# Altium project IndependentSTM32.PrjPcb
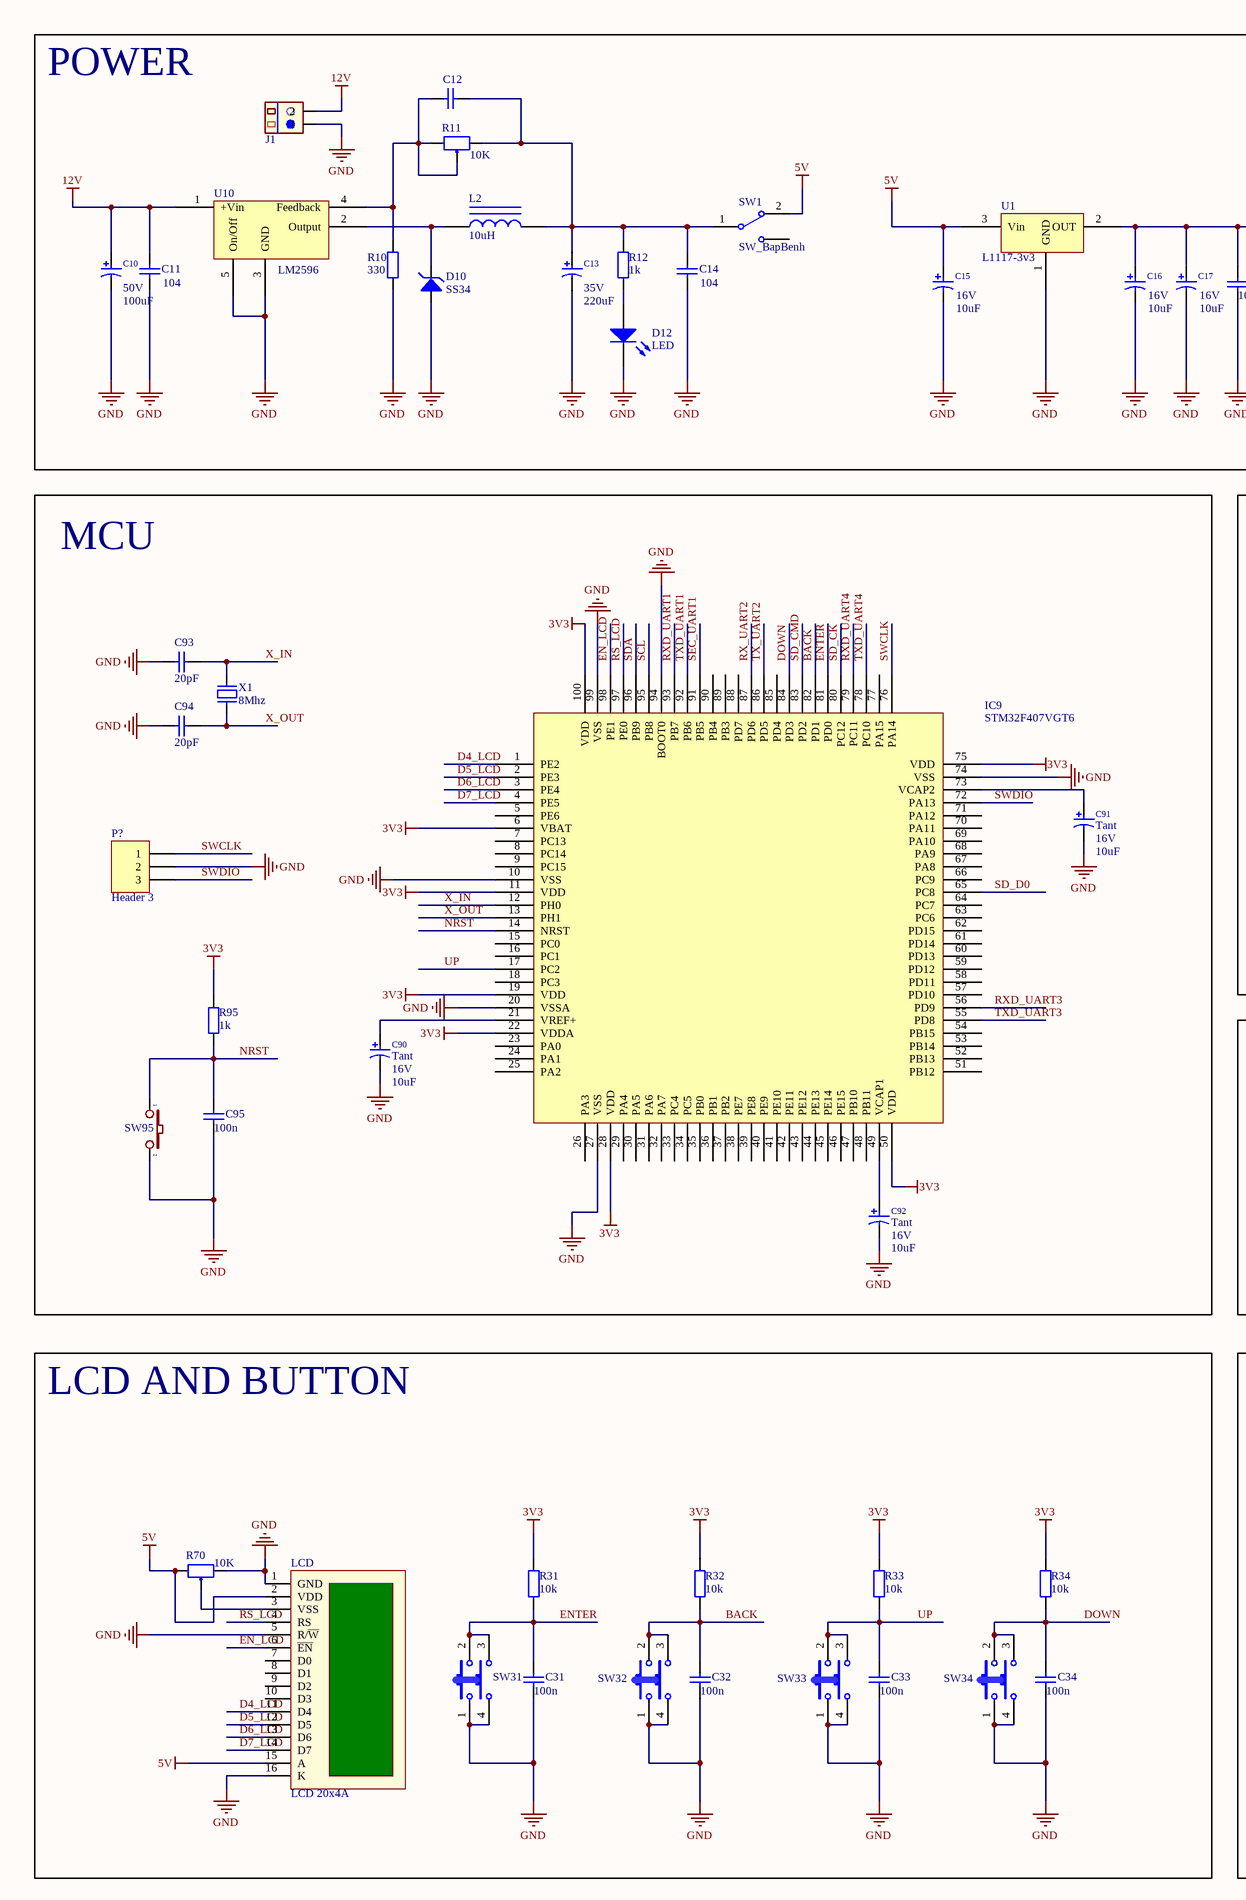
[diagram p0: IndependentSTM32.SchDoc, left]
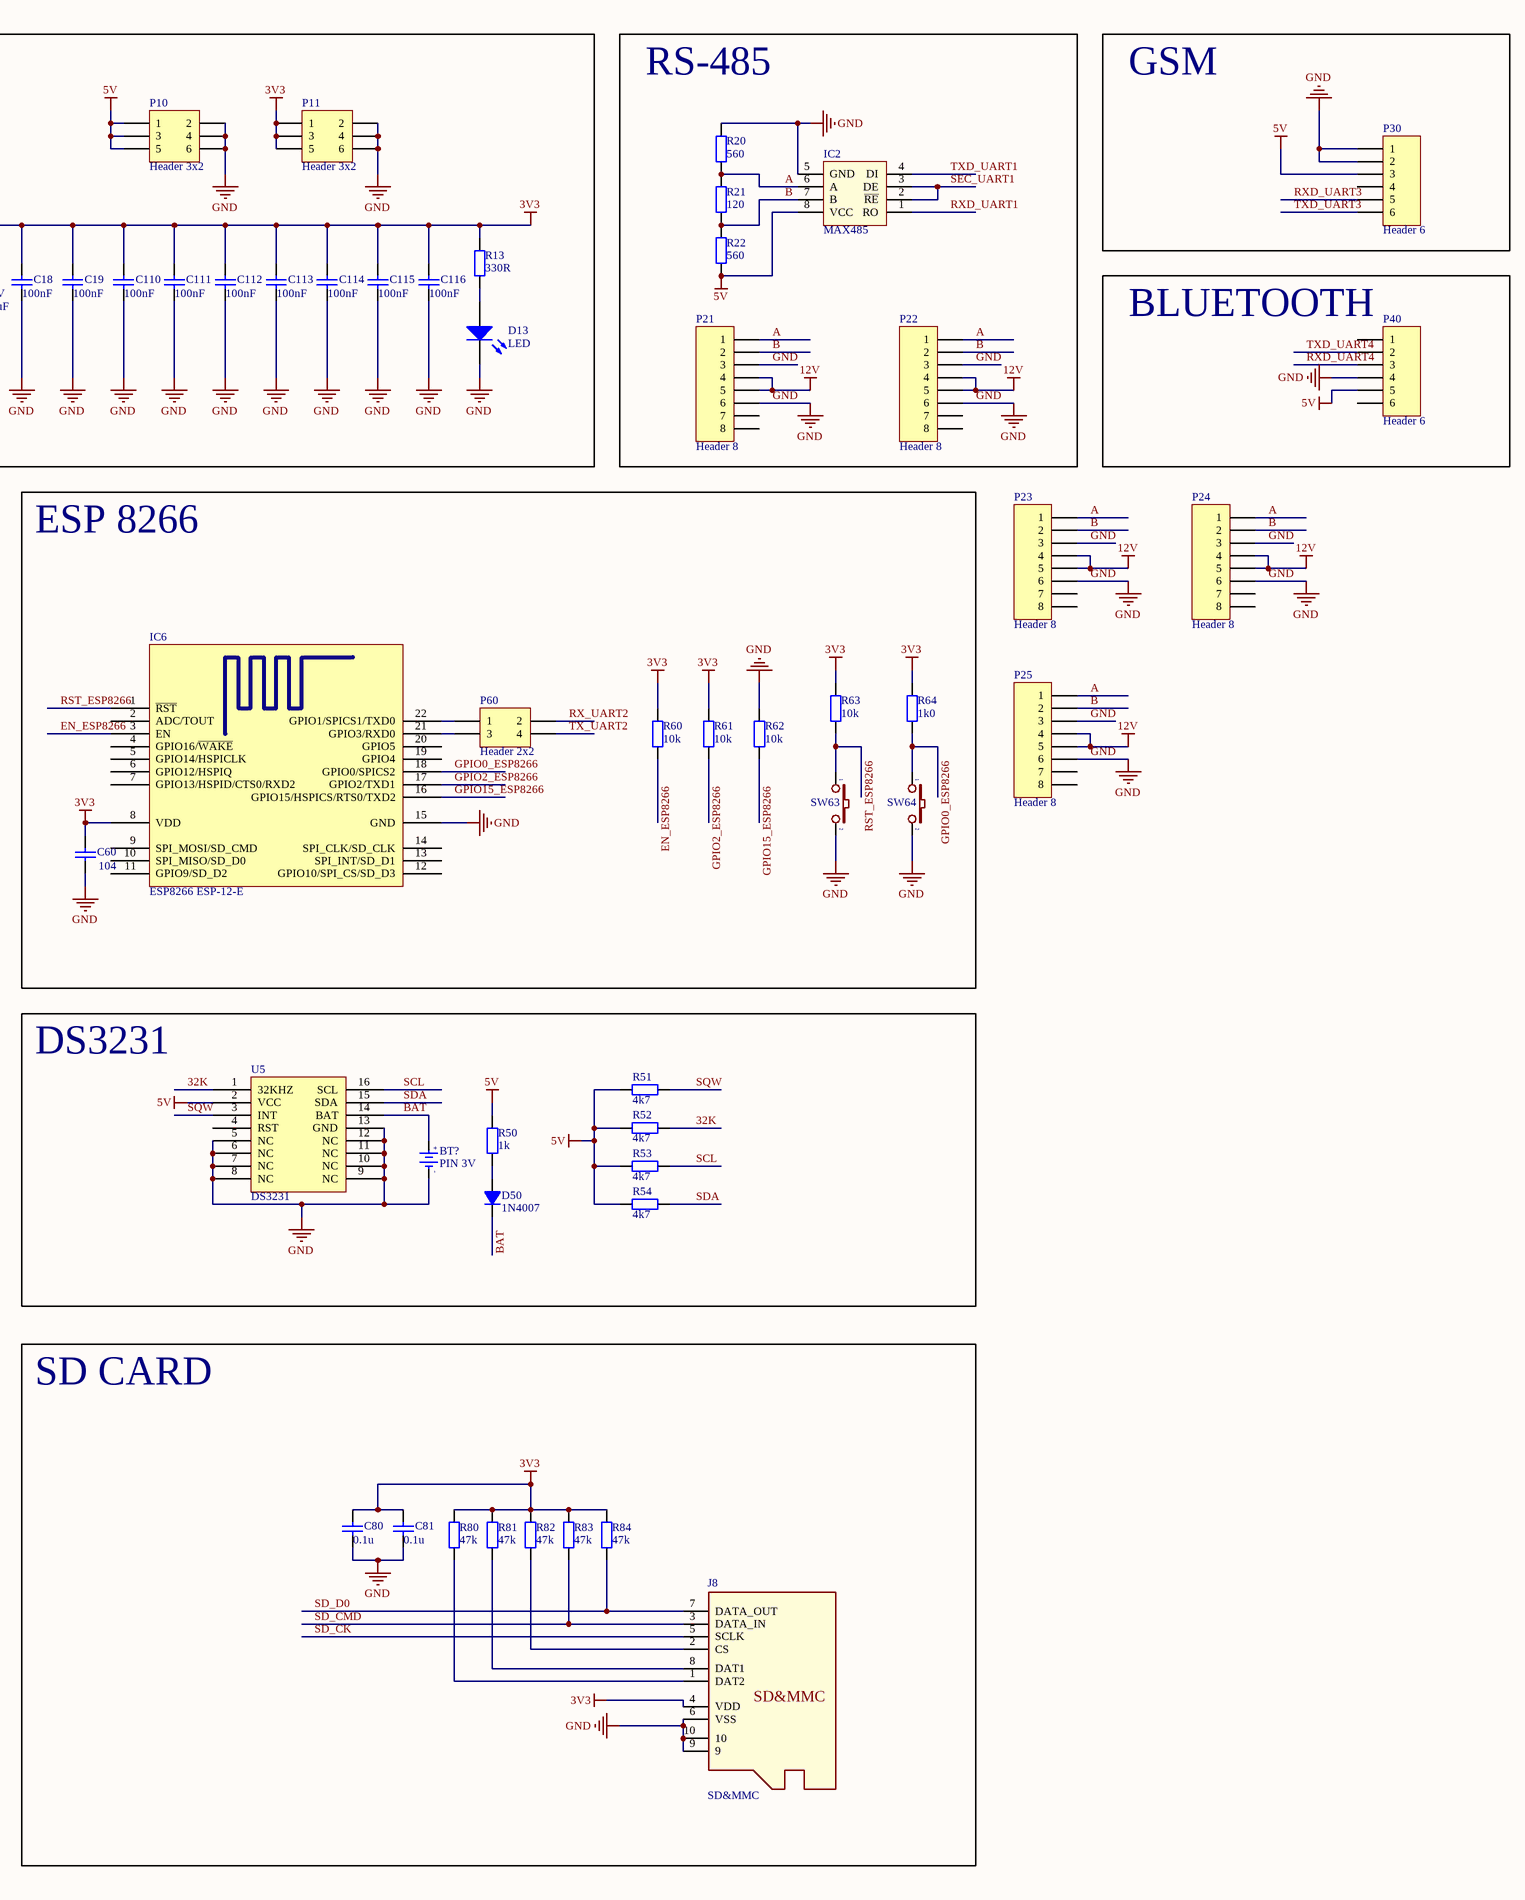
[diagram p1: IndependentSTM32.SchDoc, right]
1 sheet, 93 parts. Net scope: global (net labels, ports and power ports of the same name join across sheets).
Board file: IndependentSTM32.PcbDoc

## Sheet IndependentSTM32.SchDoc
size A2

### Parts
BT?  PIN 3V  [PIN3V]
C10  Volt: 50V  [WCAP-PSHP 8x8.7x3.1]  (hidden comment: 100uF)
C11  104  [CAP_SMD_0805]
C12  Capacitor Ceramic  [CAP_SMD_0805]  (value not drawn)
C13  Volt: 35V  [WCAP-PSHP 8x8.7x3.1]  (hidden comment: 220uF)
C14  104  [CAP_SMD_0805]
C15  Volt: 16V  [Cap_smd_4_3MM]  (hidden comment: 10uF)
C16  Volt: 16V  [Cap_smd_4_3MM]  (hidden comment: 10uF)
C17  Volt: 16V  [Cap_smd_4_3MM]  (hidden comment: 10uF)
C18  value 100nF  [CAP_SMD_0805]  (hidden comment: Capacitor Ceramic)
C19  value 100nF  [CAP_SMD_0805]  (hidden comment: Capacitor Ceramic)
C31  value 100n  [CAP_SMD_0805]  (hidden comment: Capacitor Ceramic)
C32  value 100n  [CAP_SMD_0805]  (hidden comment: Capacitor Ceramic)
C33  value 100n  [CAP_SMD_0805]  (hidden comment: Capacitor Ceramic)
C34  value 100n  [CAP_SMD_0805]  (hidden comment: Capacitor Ceramic)
C60  104  [CAP_SMD_0805]
C80  value 0.1u  [CAP_SMD_0805]  (hidden comment: Capacitor Ceramic)
C81  value 0.1u  [CAP_SMD_0805]  (hidden comment: Capacitor Ceramic)
C90  Capacitor Type: Tant  Volt: 16V  [Cap_smd_4_3MM]  (hidden comment: 10uF)
C91  Capacitor Type: Tant  Volt: 16V  [Cap_smd_4_3MM]  (hidden comment: 10uF)
C92  Capacitor Type: Tant  Volt: 16V  [Cap_smd_4_3MM]  (hidden comment: 10uF)
C93  value 20pF  [CAP_SMD_0805]  (hidden comment: Capacitor Ceramic)
C94  value 20pF  [CAP_SMD_0805]  (hidden comment: Capacitor Ceramic)
C95  value 100n  [CAP_SMD_0805]  (hidden comment: Capacitor Ceramic)
C110  value 100nF  [CAP_SMD_0805]  (hidden comment: Capacitor Ceramic)
C111  value 100nF  [CAP_SMD_0805]  (hidden comment: Capacitor Ceramic)
C112  value 100nF  [CAP_SMD_0805]  (hidden comment: Capacitor Ceramic)
C113  value 100nF  [CAP_SMD_0805]  (hidden comment: Capacitor Ceramic)
C114  value 100nF  [CAP_SMD_0805]  (hidden comment: Capacitor Ceramic)
C115  value 100nF  [CAP_SMD_0805]  (hidden comment: Capacitor Ceramic)
C116  value 100nF  [CAP_SMD_0805]  (hidden comment: Capacitor Ceramic)
D10  SS34  [DO-214AB_Unidirectional]
D12  LED  [LED-0805 RED]
D13  LED  [LED-0805 RED]
D50  1N4007  [D1A]
IC2  MAX485  [DIP8/W0.3]
IC6  ESP8266 ESP-12-E  [ESP8266 ESP-12-E]
IC9  STM32F407VGT6  [STM-LQFP100_N]
J1  CON.Domino2  [Domino 2M]  (value not drawn)
J8  SD&MMC  [MicroSD]
L2  value 10uH  [WE-PD 1260]  (hidden comment: Inductor Iron)
LCD  LCD 20x4A  [LCD20X4A]
P10  Header 3x2  [Header 3x2]
P11  Header 3x2  [Header 3x2]
P21  Header 8  [RJ11]
P22  Header 8  [RJ11]
P23  Header 8  [RJ11]
P24  Header 8  [RJ11]
P25  Header 8  [RJ11]
P30  Header 6  [Header 6]
P40  Header 6  [Header 6]
P60  Header 2x2  [Header 2x2]
P?  Header 3  [Header 3]
R10  value 330  [DIEN TRO 0805]  (hidden comment: RES_SMD_0805)
R11  10K  [VR1]
R12  value 1k  [DIEN TRO 0805]  (hidden comment: RES_SMD_0805)
R13  value 330R  [DIEN TRO 0805]  (hidden comment: RES_SMD_0805)
R20  value 560  [DIEN TRO 0805]  (hidden comment: RES_SMD_0805)
R21  value 120  [DIEN TRO 0805]  (hidden comment: RES_SMD_0805)
R22  value 560  [DIEN TRO 0805]  (hidden comment: RES_SMD_0805)
R31  value 10k  [DIEN TRO 0805]  (hidden comment: RES_SMD_0805)
R32  value 10k  [DIEN TRO 0805]  (hidden comment: RES_SMD_0805)
R33  value 10k  [DIEN TRO 0805]  (hidden comment: RES_SMD_0805)
R34  value 10k  [DIEN TRO 0805]  (hidden comment: RES_SMD_0805)
R50  value 1k  [DIEN TRO 0805]  (hidden comment: RES_SMD_0805)
R51  value 4k7  [DIEN TRO 0805]  (hidden comment: RES_SMD_0805)
R52  value 4k7  [DIEN TRO 0805]  (hidden comment: RES_SMD_0805)
R53  value 4k7  [DIEN TRO 0805]  (hidden comment: RES_SMD_0805)
R54  value 4k7  [DIEN TRO 0805]  (hidden comment: RES_SMD_0805)
R60  value 10k  [DIEN TRO 0805]  (hidden comment: RES_SMD_0805)
R61  value 10k  [DIEN TRO 0805]  (hidden comment: RES_SMD_0805)
R62  value 10k  [DIEN TRO 0805]  (hidden comment: RES_SMD_0805)
R63  value 10k  [DIEN TRO 0805]  (hidden comment: RES_SMD_0805)
R64  value 1k0  [DIEN TRO 0805]  (hidden comment: RES_SMD_0805)
R70  10K  [VR1]
R80  value 47k  [DIEN TRO 0805]  (hidden comment: RES_SMD_0805)
R81  value 47k  [DIEN TRO 0805]  (hidden comment: RES_SMD_0805)
R82  value 47k  [DIEN TRO 0805]  (hidden comment: RES_SMD_0805)
R83  value 47k  [DIEN TRO 0805]  (hidden comment: RES_SMD_0805)
R84  value 47k  [DIEN TRO 0805]  (hidden comment: RES_SMD_0805)
R95  value 1k  [DIEN TRO 0805]  (hidden comment: RES_SMD_0805)
SW1  SW_BapBenh  [SW_Bapbenh]
SW31  SW-4P-B  [SW-4P-B]  (value not drawn)
SW32  SW-4P-B  [SW-4P-B]  (value not drawn)
SW33  SW-4P-B  [SW-4P-B]  (value not drawn)
SW34  SW-4P-B  [SW-4P-B]  (value not drawn)
SW63  SW  [SW-SMD]  (value not drawn)
SW64  SW  [SW-SMD]  (value not drawn)
SW95  SW  [SW-SMD]  (value not drawn)
U1  L1117-3v3  [SOT223-4N]
U5  DS3231  [SOIC16-W]
U10  LM2596  [TO263-5]
X1  8Mhz  [XT2]

### Blocks framed on the sheet
POWER: C10-C19 C110-C116 D10 D12 D13 J1 L2 P10 P11 R10-R13 SW1 U1 U10
RS-485: IC2 P21 P22 R20-R22
GSM: P30
BLUETOOTH: P40
MCU: C90-C95 IC9 P? R95 SW95 X1
DS3231: BT? D50 R50-R54 U5
LCD AND BUTTON: C31-C34 LCD R31-R34 R70 SW31-SW34
SD CARD: C80 C81 J8 R80-R84

### Nets
3V3: C16.1 C17.1 C18.2 C19.2 C60.2 C80.2 C81.2 C110.2 C111.2 C112.2 C113.2 C114.2 C115.2 C116.2 IC6.8(VDD) IC9.6(VBAT) IC9.11(VDD) IC9.19(VDD) IC9.22(VDDA) IC9.28(VDD) IC9.50(VDD) IC9.75(VDD) IC9.100(VDD) J8.4(VDD) P11.1 P11.3 P11.5 R13.2 R31.2 R32.2 R33.2 R34.2 R60.1 R61.1 R63.1 R64.1 R80.2 R81.2 R82.2 R83.2 R84.2 R95.2 U1.2(OUT)
5V: C15.1 IC2.8(VCC) LCD.2(VDD) LCD.15(A) P10.1 P10.3 P10.5 P30.3 P40.5 R22.1 R50.2 R51.2 R52.2 R53.2 R54.2 R70.3 SW1.2 U1.3(Vin) U5.2(VCC)
12V: C10.1 C11.2 J1.2 P21.4 P21.5 P22.4 P22.5 P23.4 P23.5 P24.4 P24.5 P25.4 P25.5 U10.1(+Vin)
GND: BT?.2(GND) C10.2 C11.1 C13.2 C14.2 C15.2 C16.2 C17.2 C18.1 C19.1 C31.1 C32.1 C33.1 C34.1 C60.1 C80.1 C81.1 C90.2 C91.2 C92.2 C93.2 C94.2 C95.1 C110.1 C111.1 C112.1 C113.1 C114.1 C115.1 C116.1 D10.2 D12.2(K) D13.2(K) IC2.5(GND) IC6.15(GND) IC9.10(VSS) IC9.20(VSSA) IC9.27(VSS) IC9.74(VSS) IC9.94(BOOT0) IC9.99(VSS) J1.1 J8.6(VSS) J8.9 J8.10 LCD.1(GND) LCD.5(R/~{W}) LCD.16(K) P10.2 P10.4 P10.6 P11.2 P11.4 P11.6 P21.3 P21.6 P22.3 P22.6 P23.3 P23.6 P24.3 P24.6 P25.3 P25.6 P30.1 P30.2 P40.4 P?.2 R10.1 R20.2 R62.1 R70.1 SW31.1 SW31.4 SW32.1 SW32.4 SW33.1 SW33.4 SW34.1 SW34.4 SW63.2 SW64.2 SW95.2 U1.1(GND) U5.5(NC) U5.6(NC) U5.7(NC) U5.8(NC) U5.9(NC) U5.10(NC) U5.11(NC) U5.12(NC) U5.13(GND) U10.3(GND) U10.5(On/Off)
32K: R52.1 U5.1(32KHZ)
A: IC2.6(A) P21.1 P22.1 P23.1 P24.1 P25.1 R20.1 R21.2
B: IC2.7(B) P21.2 P22.2 P23.2 P24.2 P25.2 R21.1 R22.2
BACK: C32.2 IC9.82(PD1) R32.1 SW32.2 SW32.3
BAT: BT?.1(+3V) D50.2(K) U5.14(BAT)
D4_LCD: IC9.1(PE2) LCD.11(D4)
D5_LCD: IC9.2(PE3) LCD.12(D5)
D6_LCD: IC9.3(PE4) LCD.13(D6)
D7_LCD: IC9.4(PE5) LCD.14(D7)
DOWN: C34.2 IC9.84(PD3) R34.1 SW34.2 SW34.3
EN_ESP8266: IC6.3(EN) R60.2
EN_LCD: IC9.98(PE1) LCD.6(~{EN})
ENTER: C31.2 IC9.81(PD0) R31.1 SW31.2 SW31.3
GPIO0_ESP8266: IC6.18(GPIO0/SPICS2) R64.2 SW64.1
GPIO2_ESP8266: IC6.17(GPIO2/TXD1) R61.2
GPIO15_ESP8266: IC6.16(GPIO15/HSPICS/RTS0/TXD2) R62.2
NRST: C95.2 IC9.14(NRST) R95.1 SW95.1
RS_LCD: IC9.97(PE0) LCD.4(RS)
RST_ESP8266: IC6.1(~{RST}) R63.2 SW63.1
RX_UART2: IC9.87(PD6) P60.2
RXD_UART1: IC2.1(RO) IC9.93(PB7)
RXD_UART3: IC9.56(PD9) P30.5
RXD_UART4: IC9.79(PC11) P40.3
SCL: IC9.95(PB8) R53.1 U5.16(SCL)
SD_CK: IC9.80(PC12) J8.5(SCLK)
SD_CMD: IC9.83(PD2) J8.3(DATA_IN) R83.1
SD_D0: IC9.65(PC8) J8.7(DATA_OUT) R84.1
SDA: IC9.96(PB9) R54.1 U5.15(SDA)
SEC_UART1: IC2.2(~{RE}) IC2.3(DE) IC9.91(PB5)
SQW: R51.1 U5.3(INT)
SWCLK: IC9.76(PA14) P?.1
SWDIO: IC9.72(PA13) P?.3
TX_UART2: IC9.86(PD5) P60.4
TXD_UART1: IC2.4(DI) IC9.92(PB6)
TXD_UART3: IC9.55(PD8) P30.6
TXD_UART4: IC9.78(PC10) P40.2
UP: C33.2 IC9.17(PC2) R33.1 SW33.2 SW33.3
X_IN: C93.1 IC9.12(PH0) X1.2
X_OUT: C94.1 IC9.13(PH1) X1.1
NetC12_1: C12.1 C13.1 C14.1 L2.2 R11.1 R12.2 SW1.1
NetC12_2: C12.2 R10.2 R11.2 R11.3 U10.4(Feedback)
NetC90_1: C90.1 IC9.21(VREF+)
NetC91_1: C91.1 IC9.73(VCAP2)
NetC92_1: C92.1 IC9.49(VCAP1)
NetD10_1: D10.1 L2.1 U10.2(Output)
NetD12_1: D12.1(A) R12.1
NetD13_1: D13.1(A) R13.1
NetD50_1: D50.1(A) R50.1
NetIC6_21: IC6.21(GPIO3/RXD0) P60.3
NetIC6_22: IC6.22(GPIO1/SPICS1/TXD0) P60.1
NetJ8_1: J8.1(DAT2) R80.1
NetJ8_2: J8.2(CS) R82.1
NetJ8_8: J8.8(DAT1) R81.1
NetLCD_3: LCD.3(VSS) R70.2

Not connected (* = marked no-connect by the designer): IC6 2(ADC/TOUT) 4(GPIO16/~{WAKE}) 5(GPIO14/HSPICLK) 6(GPIO12/HSPIQ) 7(GPIO13/HSPID/CTS0/RXD2) 9(SPI_MOSI/SD_CMD) 10(SPI_MISO/SD_D0) 11(GPIO9/SD_D2) 12(GPIO10/SPI_CS/SD_D3) 13(SPI_INT/SD_D1) 14(SPI_CLK/SD_CLK) 19(GPIO4) 20(GPIO5); IC9 5(PE6) 7(PC13) 8(PC14) 9(PC15) 15(PC0) 16(PC1) 18(PC3) 23(PA0) 24(PA1) 25(PA2) 26(PA3) 29(PA4) 30(PA5) 31(PA6) 32(PA7) 33(PC4) 34(PC5) 35(PB0) 36(PB1) 37(PB2) 38(PE7) 39(PE8) 40(PE9) 41(PE10) 42(PE11) 43(PE12) 44(PE13) 45(PE14) 46(PE15) 47(PB10) 48(PB11) 51(PB12) 52(PB13) 53(PB14) 54(PB15) 57(PD10) 58(PD11) 59(PD12) 60(PD13) 61(PD14) 62(PD15) 63(PC6) 64(PC7) 66(PC9) 67(PA8) 68(PA9) 69(PA10) 70(PA11) 71(PA12) 77(PA15) 85(PD4) 88(PD7) 89(PB3) 90(PB4); LCD 7(D0) 8(D1) 9(D2) 10(D3); P21 7 8; P22 7 8; P23 7 8; P24 7 8; P25 7 8; P30 4; P40 1 6; U5 4(RST)

### Notes on the sheet
- ESP 8266
- (in symbol PIN 3V) +; -

### Library data of the parts
BT? = PIN 3V: Battery 3VDC; Value: PIN 3V
C10 C13 C15-C17 C90-C92 = Cap_Pol: Polarized Capacitor; Manufacturer: FARNELL; AEMS Code: 2100110; Vendor: Digikey; Published: 13-April-2009; Publisher: Hoang Nguyen; ComponentLink1Description: Digikey Part Link; ComponentLink2Description: Open Datasheet; ComponentLink2URL: H:\LIBRARY\LIBRARY.Datasheet\
  C10: Value: 100uF
  C13: Value: 220uF
  C15-C17 C90-C92: Value: 10uF
C11 C12 C14 C60 = CapSMD: Capacitor; Value: 33p; Published: 8-Jun-2000; LatestRevisionDate: 17-Jul-2002; LatestRevisionNote: Re-released for DXP Platform.; PackageReference: RAD-0.3; Publisher: Altium Limited
C18 C19 C31-C34 C80 C81 C93-C95 C110-C116 = CapSMD: Capacitor; Published: 8-Jun-2000; LatestRevisionDate: 17-Jul-2002; LatestRevisionNote: Re-released for DXP Platform.; PackageReference: RAD-0.3; Publisher: Altium Limited
D10 = SS34-DO214AB: WE-TVSP Power TVS Diode, Unidirectional, 1500 W, 12 VDC; partNo: 824540121; Manufacturer: Wurth Elektronik; ComponentLink1Description: Manufacturer; ComponentLink1URL: http://www.we-online.de; Created by: Baojun Chen; Created Date: Nov.2015; ComponentLink2Description: Datasheet; ComponentLink2URL: http://katalog.we-online.de/pbs/datasheet/824540121.pdf
D12 D13 = LED: Typical LED; Published: 8-Jun-2000; LatestRevisionDate: 08-Jul-2005; LatestRevisionNote: Mech Layer 1 removed.; PackageReference: LED-1; Publisher: Altium Limited
D50 = D1A: Diode 1A; Value: 1N4007
IC2 = MAX485: RS232 - RS485 (Same sn75176)
IC9 = STM32F407VGT6_IC
J1 = CON.Domino2: 2 pins Domino Header; Publisher: Hoang Nguyen; ComponentLink1Description: Digikey Part link; ComponentLink2Description: Open DataSheet; ComponentLink2URL: H:\LIBRARY\LIBRARY.Datasheet\; Price: 2000VND
J8 = MicroSD: Link: *
L2 = Inductor Iron: Magnetic-Core Inductor; Manufacturer: Generic Components; Class: Passive; Published: 1999; SubClass: Inductor
LCD = LCD20x4A: LCD dipslay 20 char, 4 line; Value: Jum 40; Value: LCD 20x4A
P10 P11 = Header 3x2: Header, 6-Pin, 2-Row; LatestRevisionDate: 17-Jul-2002; LatestRevisionNote: Re-released for DXP Platform.; Publisher: Altium Limited
P21-P25 = Header 8: Header, 8-Pin; LatestRevisionDate: 17-Jul-2002; LatestRevisionNote: Re-released for DXP Platform.; Publisher: Altium Limited
P30 P40 = Header 6: Header, 6-Pin; LatestRevisionDate: 17-Jul-2002; LatestRevisionNote: Re-released for DXP Platform.; Publisher: Altium Limited
P60 = Header 2x2: Header, 4-Pin, 2-Row; LatestRevisionDate: 17-Jul-2002; LatestRevisionNote: Re-released for DXP Platform.; Publisher: Altium Limited
P? = Header 3: Header, 3-Pin; LatestRevisionDate: 17-Jul-2002; LatestRevisionNote: Re-released for DXP Platform.; Publisher: Altium Limited
R10 R12 R13 R20-R22 R31-R34 R50-R54 R60-R64 R80-R84 R95 = RES_SMD_0805: RES_0805; Published: 8-Jun-2000; LatestRevisionDate: 17-Jul-2002; LatestRevisionNote: Re-released for DXP Platform.; PackageReference: AXIAL-0.4; Publisher: Altium Limited
R11 R70 = VR: Var Resistor; Value: VR 10K
SW31-SW34 = SW-4PIN-BIG: Switch Big 4 Pin; Published: 24-Mar-1999; LatestRevisionDate: 17-Jul-2002; LatestRevisionNote: Re-released for DXP Platform.; PackageReference: SPST-2; Publisher: Altium Limited
SW63 SW64 SW95 = SW2: Switch button 2 pin; Value: SW chip 2 pin
X1 = XT2: Crystal For all Crystal 2pin.; Value: 4Mhz